# Altium schematic sheet Motor_PowerMosfet.SchDoc
size A4; DrawnBy: Caner ALP; DocumentNumber: 4; SheetNumber: 4; SheetTotal: 4
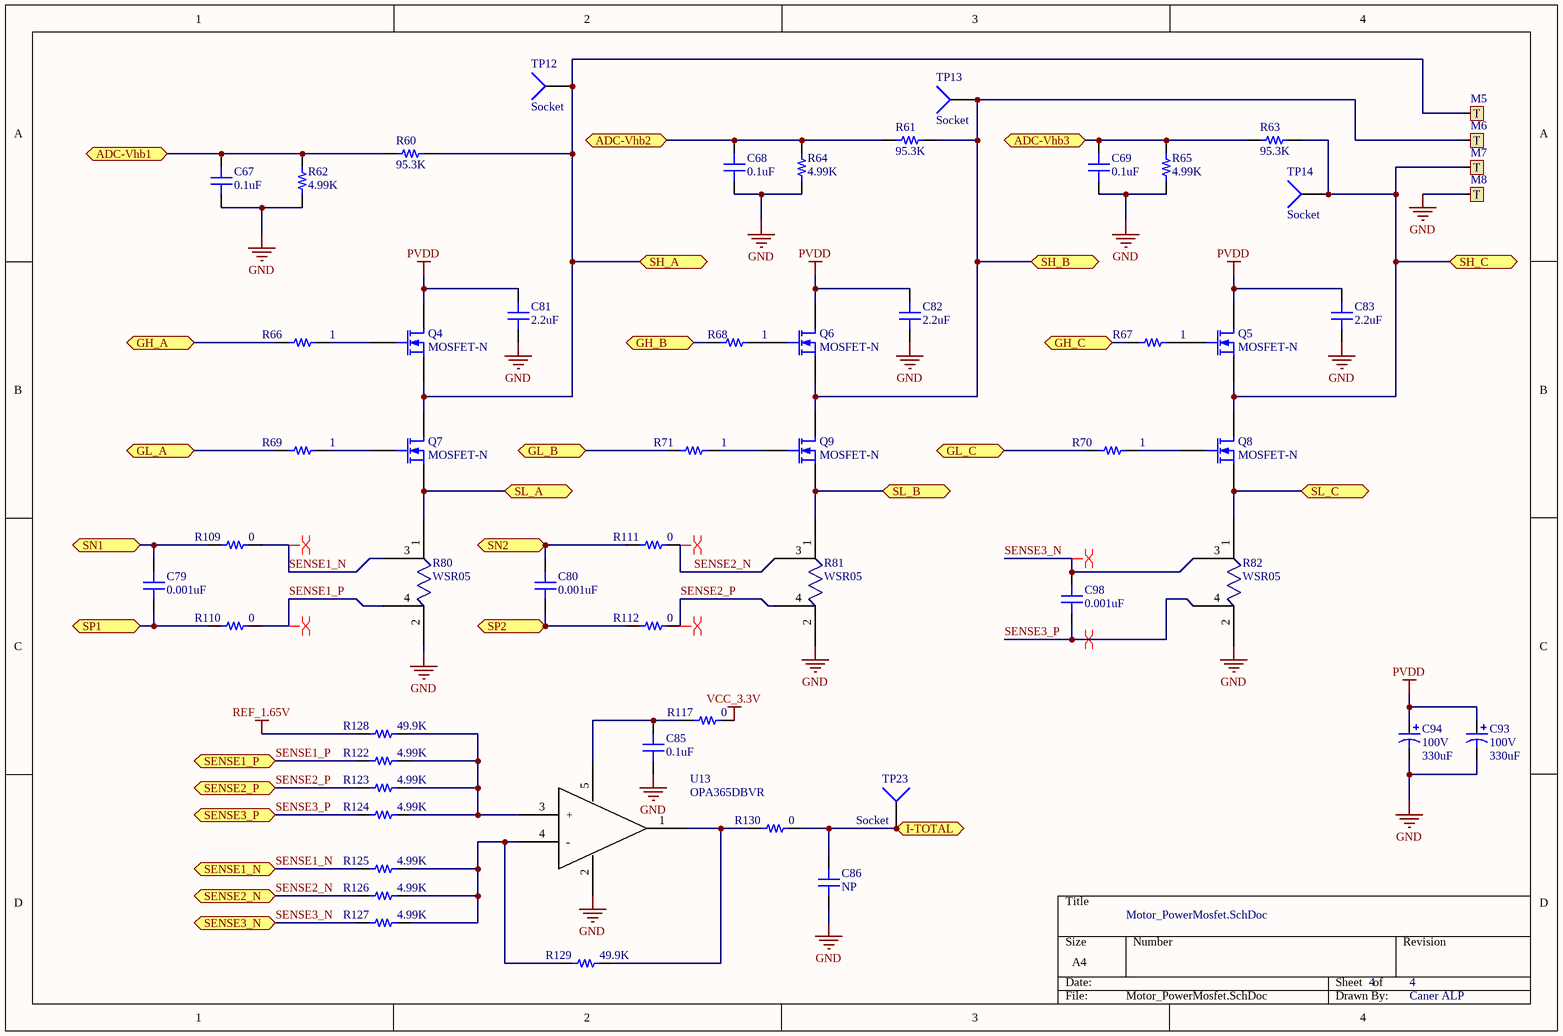
[diagram p0: Motor_PowerMosfet.SchDoc]

## Parts
C67  0.1uF  [CAP 0603/1608]
C68  0.1uF  [CAP 0603/1608]
C69  0.1uF  [CAP 0603/1608]
C79  0.001uF  [CAP 0603/1608]
C80  0.001uF  [CAP 0603/1608]
C81  2.2uF  [CAP 1210/3225 - 2.5MM]
C82  2.2uF  [CAP 1210/3225 - 2.5MM]
C83  2.2uF  [CAP 1210/3225 - 2.5MM]
C85  0.1uF  [CAP 0603/1608]
C86  NP  [CAP 0603/1608]
C93  100V  value 330uF  [RB7.6-15]
C94  100V  value 330uF  [RB7.6-15]
C98  0.001uF  [CAP 0603/1608]
M5  Conn  [M5 Nut]  (value not drawn)
M6  Conn  [M5 Nut]  (value not drawn)
M7  Conn  [M5 Nut]  (value not drawn)
M8  Conn  [M5 Nut]  (value not drawn)
Q4  MOSFET-N  [TO263]
Q5  MOSFET-N  [TO263]
Q6  MOSFET-N  [TO263]
Q7  MOSFET-N  [TO263]
Q8  MOSFET-N  [TO263]
Q9  MOSFET-N  [TO263]
R60  95.3K  [RES 0603/1608]
R61  95.3K  [RES 0603/1608]
R62  4.99K  [RES 0603/1608]
R63  95.3K  [RES 0603/1608]
R64  4.99K  [RES 0603/1608]
R65  4.99K  [RES 0603/1608]
R66  1  [RES 0603/1608]
R67  1  [RES 0603/1608]
R68  1  [RES 0603/1608]
R69  1  [RES 0603/1608]
R70  1  [RES 0603/1608]
R71  1  [RES 0603/1608]
R80  WSR05  [RES]  (net tie, no BOM)
R81  WSR05  [RES]  (net tie, no BOM)
R82  WSR05  [RES]  (net tie, no BOM)
R109  0  [RES 0603/1608]
R110  0  [RES 0603/1608]
R111  0  [RES 0603/1608]
R112  0  [RES 0603/1608]
R117  0  [RES 0603/1608]
R122  4.99K  [RES 0603/1608]
R123  4.99K  [RES 0603/1608]
R124  4.99K  [RES 0603/1608]
R125  4.99K  [RES 0603/1608]
R126  4.99K  [RES 0603/1608]
R127  4.99K  [RES 0603/1608]
R128  49.9K  [RES 0603/1608]
R129  49.9K  [RES 0603/1608]
R130  0  [RES 0603/1608]
TP12  Socket  [PIN1]
TP13  Socket  [PIN1]
TP14  Socket  [PIN1]
TP23  Socket  [PIN1]
U13  OPA365DBVR  [DBV005]

## Ports
ADC-Vhb1, ADC-Vhb2, ADC-Vhb3, GH_A, GH_B, GH_C, GL_A, GL_B, GL_C, I-TOTAL, SENSE1_N, SENSE1_P, SENSE2_N, SENSE2_P, SENSE3_N, SENSE3_P, SH_A, SH_B, SH_C, SL_A, SL_B, SL_C, SN1, SN2, SP1, SP2

## Nets
GND: C67.1 C68.1 C69.1 C81.1 C82.1 C83.1 C85.1 C86.1 C93.2 C94.2 M8.1(T) R62.1 R64.1 R65.1 R80.2 R81.2 R82.2 U13.2
PVDD: C81.2 C82.2 C83.2 C93.1 C94.1 Q4.1(D) Q5.1(D) Q6.1(D)
REF_1.65V: R128.2
VCC_3.3V: R117.1
ADC-Vhb1: C67.2 R60.2 R62.2 ; port ADC-Vhb1
ADC-Vhb2: C68.2 R61.2 R64.2 ; port ADC-Vhb2
ADC-Vhb3: C69.2 R63.2 R65.2 ; port ADC-Vhb3
GH_A: R66.2 ; port GH_A
GH_B: R68.2 ; port GH_B
GH_C: R67.2 ; port GH_C
GL_A: R69.2 ; port GL_A
GL_B: R71.2 ; port GL_B
GL_C: R70.2 ; port GL_C
I-TOTAL: C86.2 R130.1 TP23.1 ; port I-TOTAL
SENSE1_N: R80.3 R109.1 R125.2 ; port SENSE1_N
SENSE1_P: R80.4 R110.1 R122.2 ; port SENSE1_P
SENSE2_N: R81.3 R111.1 R126.2 ; port SENSE2_N
SENSE2_P: R81.4 R112.1 R123.2 ; port SENSE2_P
SENSE3_N: C98.2 R82.3 R127.2 ; port SENSE3_N
SENSE3_P: C98.1 R82.4 R124.2 ; port SENSE3_P
SH_A: M5.1(T) Q4.3(S) Q7.1(D) R60.1 TP12.1 ; port SH_A
SH_B: M6.1(T) Q6.3(S) Q9.1(D) R61.1 TP13.1 ; port SH_B
SH_C: M7.1(T) Q5.3(S) Q8.1(D) R63.1 TP14.1 ; port SH_C
SL_A: Q7.3(S) R80.1 ; port SL_A
SL_B: Q9.3(S) R81.1 ; port SL_B
SL_C: Q8.3(S) R82.1 ; port SL_C
SN1: C79.2 R109.2 ; port SN1
SN2: C80.2 R111.2 ; port SN2
SP1: C79.1 R110.2 ; port SP1
SP2: C80.1 R112.2 ; port SP2
NetC85_2: C85.2 R117.2 U13.5
NetQ4_2: Q4.2(G) R66.1
NetQ5_2: Q5.2(G) R67.1
NetQ6_2: Q6.2(G) R68.1
NetQ7_2: Q7.2(G) R69.1
NetQ8_2: Q8.2(G) R70.1
NetQ9_2: Q9.2(G) R71.1
NetR122_1: R122.1 R123.1 R124.1 R128.1 U13.3(+)
NetR125_1: R125.1 R126.1 R127.1 R129.2 U13.4(-)
NetR129_1: R129.1 R130.2 U13.1

## Layout directives
differential pair: SENSE1_N, SENSE1_P, SENSE2_N, SENSE2_P, SENSE3_N, SENSE3_P

## Library data of the parts
C67-C69 C79 C80 C85 C86 C98 = CC0603KPX7R7BB104: CAP CER 0.1UF 16V X7R 0603; Manufacturer: Yageo; TemperatureRange: -55C ~ 125C; Tolerance: 10%; Value: 0.1uF; Part Number: CC0603KPX7R7BB104; PartId: 5262; Supplier 1: Digi-Key; Supplier Part Number 1: 311-1335-2-ND; ComponentLink1Description: Datasheet; ComponentLink1URL: http://www.yageo.com/documents/recent/UPY-GPHC_X7R_6.3V-to-50V-v12.pdf; ComponentLink2Description: Digi-Key listing; ComponentLink2URL: http://digikey.com/product-detail/en/CC0603KPX7R7BB104/311-1335-2-ND/2103073; TemperatureCoefficient: X7R; Voltage: 16V; Price: 0,0043; Type: -; Device Package: 0603 (1608 Metric)
C81-C83 = C3225X7R2A225K230AM: CAP CER 2.2UF 100V X7R 1210; Manufacturer: TDK Corporation; TemperatureRange: -55C ~ 125C; Tolerance: 10%; Value: 2.2uF; Part Number: C3225X7R2A225K230AM; PartId: 18956; Supplier 1: Digi-Key; Supplier Part Number 1: 445-6098-2-ND; ComponentLink1Description: Datasheet; ComponentLink1URL: https://product.tdk.com/info/en/catalog/datasheets/mlcc_commercial_openmode_en.pdf; ComponentLink2Description: Digi-Key Listing; ComponentLink2URL: https://www.digikey.com/product-detail/en/tdk-corporation/C3225X7R2A225K230AM/445-6098-2-ND/2443575; TemperatureCoefficient: X7R; Voltage: 100V; Price: 0,3129; Device Package: 1210 (3225 Metric)
C93 C94 = Cap Pol1: Polarized Capacitor (Radial); Published: 8-Jun-2000; LatestRevisionDate: 17-Jul-2002; LatestRevisionNote: Re-released for DXP Platform.; PackageReference: RB7.6-15; Publisher: Altium Limited; PackageDescription: Polarized Capacitor (Radial); 2 Leads
M5-M8 = 1 Conn
Q4-Q9 = MOSFET-N: N-Channel MOSFET; Published: 8-Jun-2000; LatestRevisionDate: 17-Jul-2002; LatestRevisionNote: Re-released for DXP Platform.; PackageVersion: 1995/1996; PackageReference: E3; Publisher: Altium Limited; PackageDescription: TO, Flat Index; 3 In-Line, Axial Leads; Body Dia. 4.6mm; Lead Dia. 0.5 mm (max)
R60-R71 R109-R112 R117 R122-R130 = ERJ-3GEYJ331V: RES SMD 330 OHM 5% 1/10W 0603; Manufacturer: Panasonic Electronic Components; Value: 330; TemperatureRange: -55C ~ 155C; TemperatureCoefficient: 200ppm/C; PowerRating: 0.1W, 1/10W; Part Number: ERJ-3GEYJ331V; PartId: 11189; Supplier 1: Digi-Key; Supplier Part Number 1: P330GTR-ND; ComponentLink1Description: Datasheet; ComponentLink1URL: http://industrial.panasonic.com/www-cgi/jvcr13pz.cgi?E+PZ+3+AOA0001+ERJ3GEYJ331V+7+WW; ComponentLink2Description: Digi-Key Listing; ComponentLink2URL: https://www.digikey.com/product-detail/en/panasonic-electronic-components/ERJ-3GEYJ331V/P330GTR-ND/135755; Tolerance: 5%; Price: 0,002; Device Package: 0603 (1608 Metric)
U13 = TLV2781DBVR
TP12-TP14 TP23 = Socket: LatestRevisionDate: 17-Jul-2002; LatestRevisionNote: Re-released for DXP Platform.; Publisher: Altium Limited